# EAGLE design 4-way-CoreCard (EAGLE 4.16)
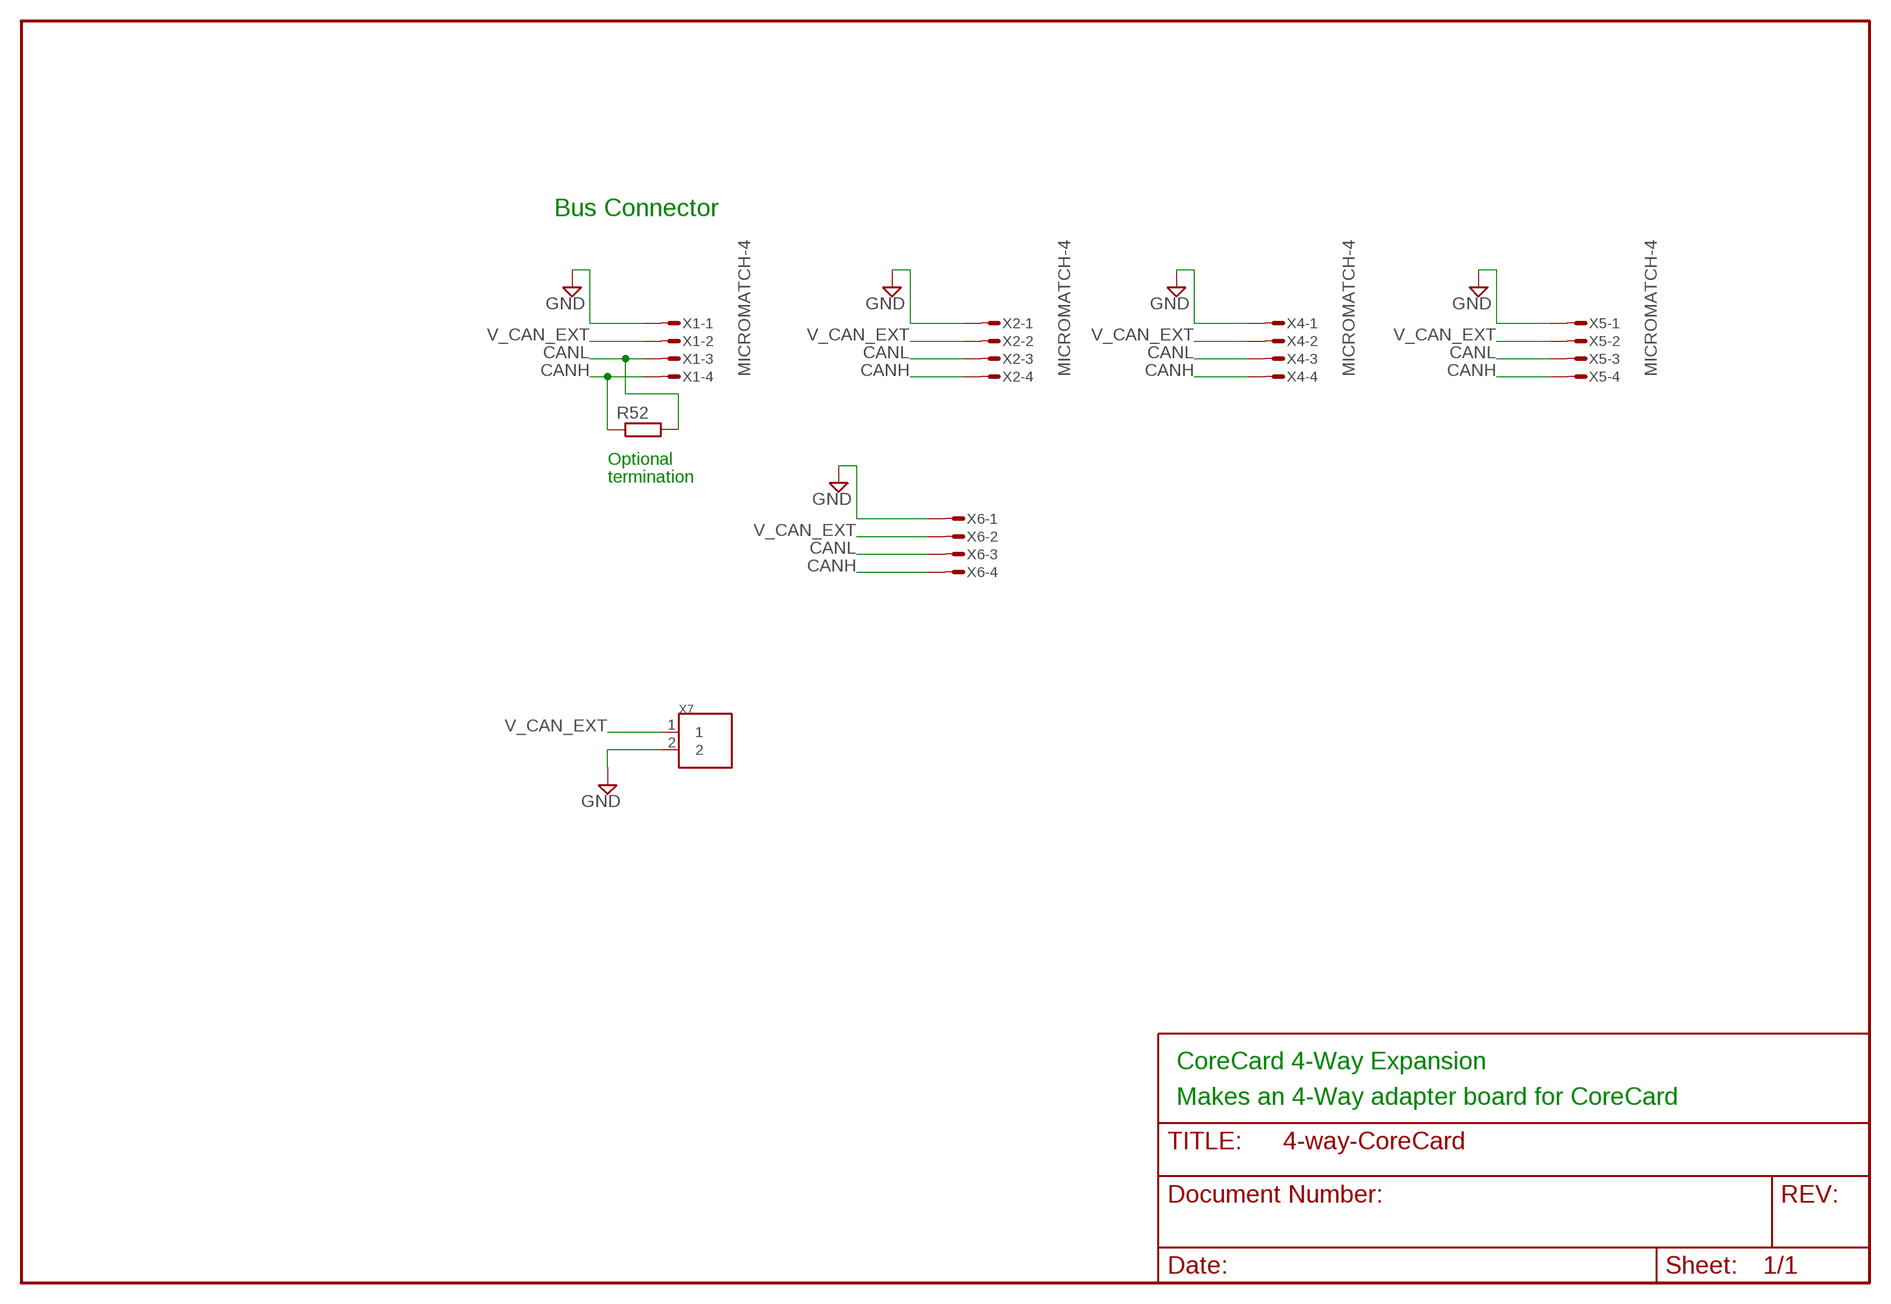
[diagram p0: schematic, sheet 1]

## Parts
R52  R-EUR0603  [R0603]
X1  MICROMATCH-4  [MICROMATCH-4]
X2  MICROMATCH-4  [MICROMATCH-4]
X4  MICROMATCH-4  [MICROMATCH-4]
X5  MICROMATCH-4  [MICROMATCH-4]
X6  MICROMATCH-4-MALE  [MICROMATCH-4-MALE]
X7  BLOCK22.54  [PCB2]

## Nets
CANH: R52.1 X1.4 X2.4 X4.4 X5.4 X6.4
CANL: R52.2 X1.3 X2.3 X4.3 X5.3 X6.3
GND: X1.1 X2.1 X4.1 X5.1 X6.1 X7.2
V_CAN_EXT: X1.2 X2.2 X4.2 X5.2 X6.2 X7.1

## Notes on the sheet
- Bus Connector
- Optional
- termination
- CoreCard 4-Way Expansion
- Makes an 4-Way adapter board for CoreCard

## Library data of the parts
R52 = rcl:R-EU
X1 X2 X4 X5 = con-amp-micromatch:MICROMATCH-4: MicroMaTch 4 7-215464-4 / 0-215464-4 Drawing Number C-215464 DDEController.pdf
X6 = con-amp-micromatch:MICROMATCH-4-MALE
X7 = terminal_block:BLOCK2

## Board
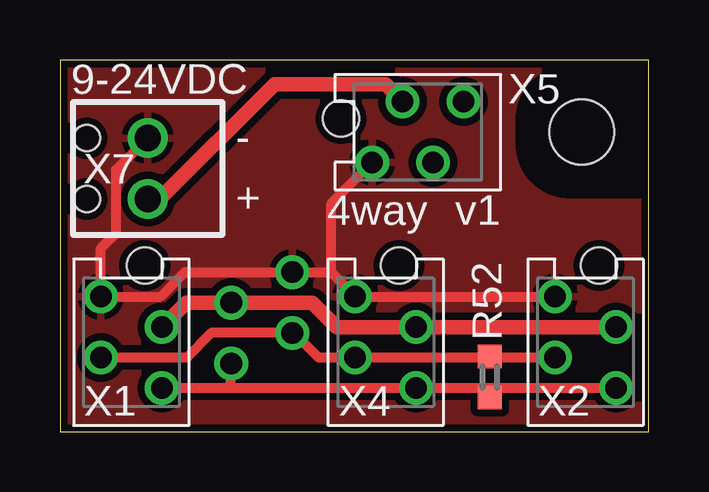
[diagram p1: board, top side]
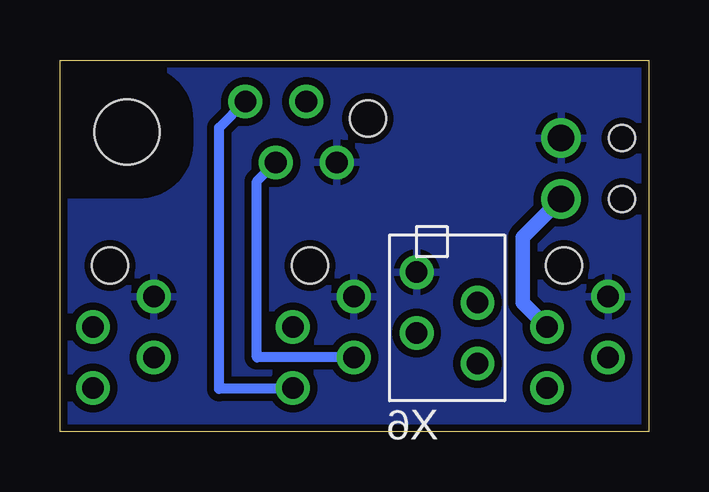
[diagram p2: board, bottom side, seen from below]

Size 24.54 x 15.49 mm. Coordinates in mm from the lower left corner, seen from the top.
Outline: 0,0 24.54,0 24.54,15.49 0,15.49 0,0
Copper layers (1*16): Top 0.035mm / dielectric 1.5mm / Bottom 0.035mm
Design rules "default": minimum track width 10mil, minimum drill 0.6mm, track to track 10mil, track to pad 10mil, pad to pad 10mil, via to via 10mil, smd to smd 8mil, copper to edge 10mil, drill to drill 8mil, minimum pad ring 10mil, minimum via ring 10mil, stop-mask expansion 4mil, vias tented up to drill 0mil, thermal gap 10mil
Holes 2.7 mm at 21.74,12.5

### Footprints (pad centres in the part's own frame; a part is rotated, then mirrored left to right if it is on the bottom)
R0603 = smd 0.991 x 1.016: 1 -0.85,0; 2 0.85,0
MICROMATCH-4 = drill 0.9 round: 1 1.905,1.27; 2 0.635,-1.27; 3 -0.635,1.27; 4 -1.905,-1.27 | hole 1.5: 3.199,-0.562
MICROMATCH-4-MALE = drill 0.9 round: 1 5.715,1.27; 2 4.445,3.81; 3 3.175,1.27; 4 1.905,3.81
PCB2 = drill 1.1 round: 1 -2.54,0; 2 0,0 | hole 1.1: -2.54,2.54; 0,2.54

### Placement (x,y rotation side)
R52  17.91,2.29 90 top
X1  2.97,3.73 90 top
X2  21.89,3.73 90 top
X4  13.56,3.73 90 top
X5  14.91,12.5 180 top
X6  10.95,0.94 90 top
X7  3.66,12.24 90 top

### Tracks (layer width: path | path; a pad name or v marks a point on that pad's centre or on a via)
CANH
  Top 0.406: 17.91,1.83 X4.4 7.11,1.83 | 17.91,1.83 X2.4 | X1.4 7.11,1.83 | 17.91,1.83 R52.1 | X6.4 7.11,2.82 7.11,1.83
  Bottom 0.406: X5.4 17.91,12.67 17.91,1.78 17.88,1.8 14.81,1.8 X4.4
CANL
  Top 0.406: X4.3 12.24,3.1 | X4.3 17.91,3.1 | 17.91,3.1 X2.3 | X1.3 5.31,3.1 6.32,4.14 9.68,4.14 | 17.91,3.1 17.91,3.07 | 17.91,3.1 R52.2 | 9.68,4.14 9.7,4.14 | 9.68,4.14 X6.3 9.7,4.11 9.73,4.14 10.77,3.1 X4.3
  Bottom 0.406: X5.3 16.33,10.44 16.33,3.1 X4.3
GND
  Top 0.406: 11.3,6.65 12.32,5.64 X4.1 X2.1 20.68,5.64 | X7.2 2.34,10.92 2.34,8.28 1.7,7.65 X1.1 4.19,5.64 5.21,6.65 X6.1 11.3,6.65 | X5.1 11.3,9.52 11.3,6.65
  pour Bottom (isolate 0.305, rank 3): 21.23,15.44 arc90 18.82,13 18.82,11.99 arc90 21.23,9.58 24.54,9.58 24.54,0 0,0 0,15.44
  pour Top (isolate 0.305, rank 3): 21.23,15.44 arc90 18.82,13 18.82,11.99 arc90 21.23,9.58 24.54,9.58 24.54,0 0,0 0,15.44
V_CAN_EXT
  Top 0.61: X2.2 X4.2 11.53,4.37 10.52,5.38 X6.2 5.26,5.38 X1.2 | X5.2 13.56,14.48 8.94,14.48 4.17,9.7 X7.1
  Bottom 0.61: X7.1 5.26,8.1 5.26,5.38 X1.2

### Text on the board
tPlace: 9-24VDC | - | + | 4way | v1
Document: Top is component side | Expansion will be mounted bottom to bottom with CoreCard | Change vertical dimension to fit | Remove I/O-header silcscreen if neccesary | Remove mounting holes if neccesary